# Altium schematic sheet LevelShift.schdoc
size 298 x 226 mm
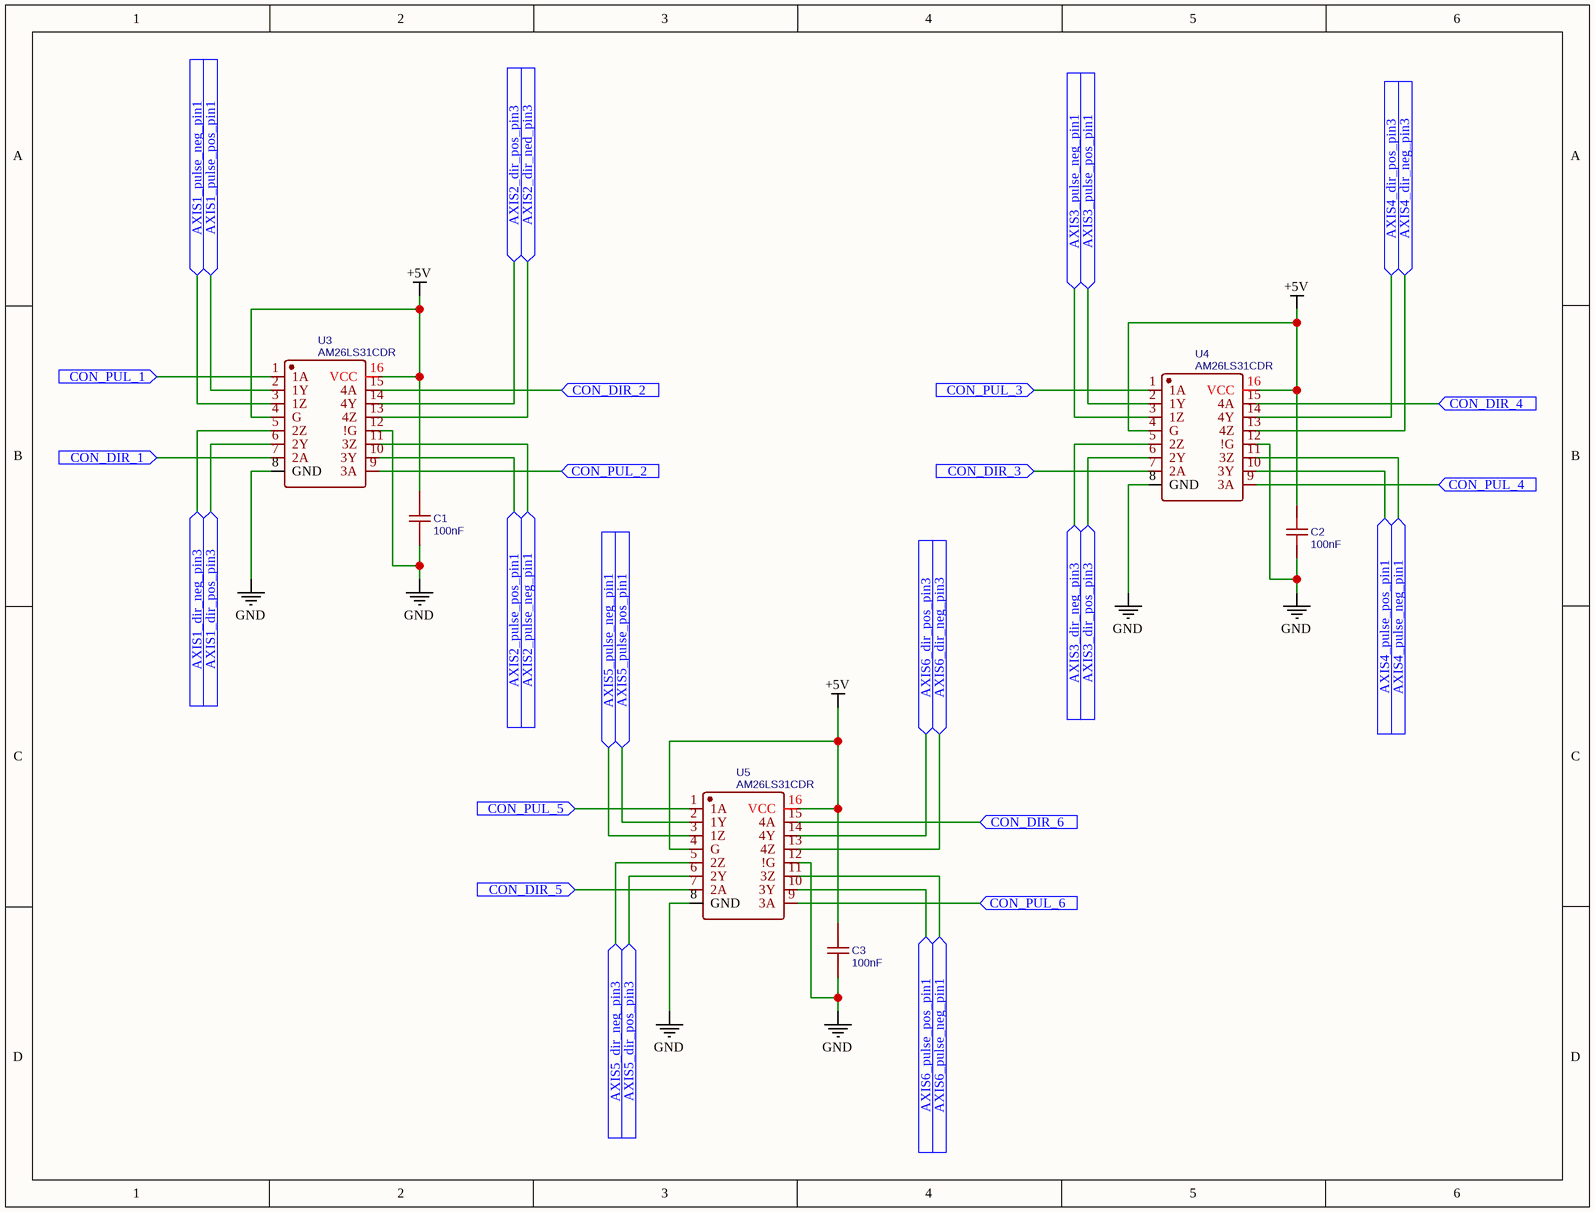
[diagram p0: LevelShift.schdoc]

## Parts
C1  100nF  [C0805]
C2  100nF  [C0805]
C3  100nF  [C0805]
U3  AM26LS31CDR  [SOIC-16_L9.9-W3.9-P1.27-LS6.0-BL]
U4  AM26LS31CDR  [SOIC-16_L9.9-W3.9-P1.27-LS6.0-BL]
U5  AM26LS31CDR  [SOIC-16_L9.9-W3.9-P1.27-LS6.0-BL]

## Ports
AXIS1_dir_neg_pin3 (in), AXIS1_dir_pos_pin3 (in), AXIS1_pulse_neg_pin1 (in), AXIS1_pulse_pos_pin1 (in), AXIS2_dir_ned_pin3 (in), AXIS2_dir_pos_pin3 (in), AXIS2_pulse_neg_pin1 (in), AXIS2_pulse_pos_pin1 (in), AXIS3_dir_neg_pin3 (in), AXIS3_dir_pos_pin3 (in), AXIS3_pulse_neg_pin1 (in), AXIS3_pulse_pos_pin1 (in), AXIS4_dir_neg_pin3 (in), AXIS4_dir_pos_pin3 (in), AXIS4_pulse_neg_pin1 (in), AXIS4_pulse_pos_pin1 (in), AXIS5_dir_neg_pin3 (in), AXIS5_dir_pos_pin3 (in), AXIS5_pulse_neg_pin1 (in), AXIS5_pulse_pos_pin1 (in), AXIS6_dir_neg_pin3 (in), AXIS6_dir_pos_pin3 (in), AXIS6_pulse_neg_pin1 (in), AXIS6_pulse_pos_pin1 (in), CON_DIR_1 (in), CON_DIR_2 (in), CON_DIR_3 (in), CON_DIR_4 (in), CON_DIR_5 (in), CON_DIR_6 (in), CON_PUL_1 (in), CON_PUL_2 (in), CON_PUL_3 (in), CON_PUL_4 (in), CON_PUL_5 (in), CON_PUL_6 (in)

## Nets
+5V: C1.1 C2.1 C3.1 U3.4(G) U3.16(VCC) U4.4(G) U4.16(VCC) U5.4(G) U5.16(VCC)
GND: C1.2 C2.2 C3.2 U3.8(GND) U3.12(!G) U4.8(GND) U4.12(!G) U5.8(GND) U5.12(!G)
AXIS1_dir_neg_pin3: U3.5(2Z) ; port AXIS1_dir_neg_pin3
AXIS1_dir_pos_pin3: U3.6(2Y) ; port AXIS1_dir_pos_pin3
AXIS1_pulse_neg_pin1: U3.3(1Z) ; port AXIS1_pulse_neg_pin1
AXIS1_pulse_pos_pin1: U3.2(1Y) ; port AXIS1_pulse_pos_pin1
AXIS2_dir_ned_pin3: U3.13(4Z) ; port AXIS2_dir_ned_pin3
AXIS2_dir_pos_pin3: U3.14(4Y) ; port AXIS2_dir_pos_pin3
AXIS2_pulse_neg_pin1: U3.11(3Z) ; port AXIS2_pulse_neg_pin1
AXIS2_pulse_pos_pin1: U3.10(3Y) ; port AXIS2_pulse_pos_pin1
AXIS3_dir_neg_pin3: U4.5(2Z) ; port AXIS3_dir_neg_pin3
AXIS3_dir_pos_pin3: U4.6(2Y) ; port AXIS3_dir_pos_pin3
AXIS3_pulse_neg_pin1: U4.3(1Z) ; port AXIS3_pulse_neg_pin1
AXIS3_pulse_pos_pin1: U4.2(1Y) ; port AXIS3_pulse_pos_pin1
AXIS4_dir_neg_pin3: U4.13(4Z) ; port AXIS4_dir_neg_pin3
AXIS4_dir_pos_pin3: U4.14(4Y) ; port AXIS4_dir_pos_pin3
AXIS4_pulse_neg_pin1: U4.11(3Z) ; port AXIS4_pulse_neg_pin1
AXIS4_pulse_pos_pin1: U4.10(3Y) ; port AXIS4_pulse_pos_pin1
AXIS5_dir_neg_pin3: U5.5(2Z) ; port AXIS5_dir_neg_pin3
AXIS5_dir_pos_pin3: U5.6(2Y) ; port AXIS5_dir_pos_pin3
AXIS5_pulse_neg_pin1: U5.3(1Z) ; port AXIS5_pulse_neg_pin1
AXIS5_pulse_pos_pin1: U5.2(1Y) ; port AXIS5_pulse_pos_pin1
AXIS6_dir_neg_pin3: U5.13(4Z) ; port AXIS6_dir_neg_pin3
AXIS6_dir_pos_pin3: U5.14(4Y) ; port AXIS6_dir_pos_pin3
AXIS6_pulse_neg_pin1: U5.11(3Z) ; port AXIS6_pulse_neg_pin1
AXIS6_pulse_pos_pin1: U5.10(3Y) ; port AXIS6_pulse_pos_pin1
CON_DIR_1: U3.7(2A) ; port CON_DIR_1
CON_DIR_2: U3.15(4A) ; port CON_DIR_2
CON_DIR_3: U4.7(2A) ; port CON_DIR_3
CON_DIR_4: U4.15(4A) ; port CON_DIR_4
CON_DIR_5: U5.7(2A) ; port CON_DIR_5
CON_DIR_6: U5.15(4A) ; port CON_DIR_6
CON_PUL_1: U3.1(1A) ; port CON_PUL_1
CON_PUL_2: U3.9(3A) ; port CON_PUL_2
CON_PUL_3: U4.1(1A) ; port CON_PUL_3
CON_PUL_4: U4.9(3A) ; port CON_PUL_4
CON_PUL_5: U5.1(1A) ; port CON_PUL_5
CON_PUL_6: U5.9(3A) ; port CON_PUL_6

## Library data of the parts
C1-C3 = 100nF: Manufacturer: YAGEO; Manufacturer Part: CC0805KRX7R8BB104; nameAlias: Capacitance; Contributor: LCSC; Supplier: LCSC; Supplier Part: C519981; JLCPCB Part Class: Extended Part; spicePre: C; spiceSymbolName: CC0805KRX7R8BB104
U3-U5 = AM26LS31CDR: Manufacturer: TI(德州仪器); spicePre: X; Supplier: LCSC; Manufacturer Part: AM26LS31CDR; Supplier Part: C6179; JLCPCB Part Class: Extended Part; link: https://lcsc.com/eda_search?q=C6179&%26type=1&ref=editor; spiceSymbolName: AM26LS31CDR